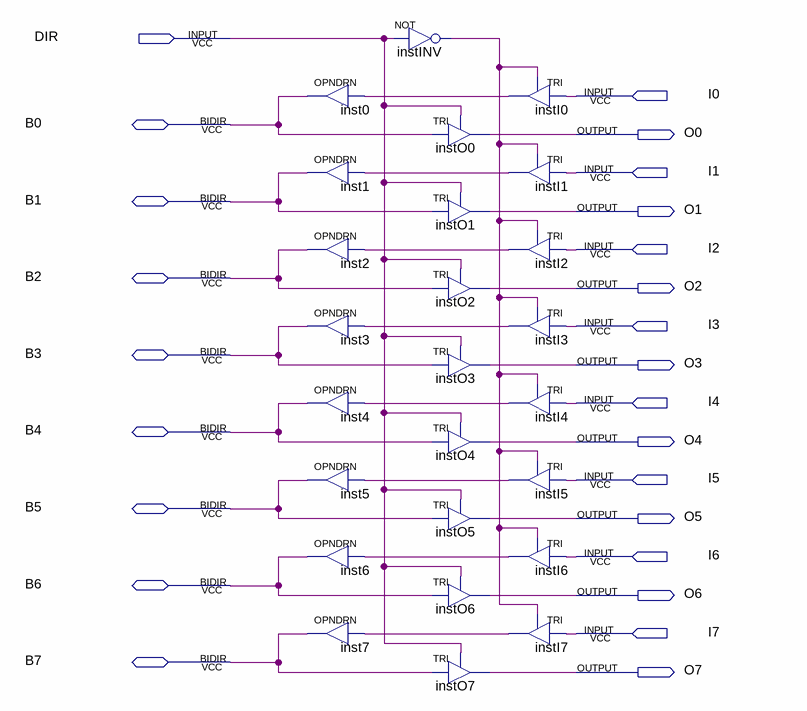
[diagram p0: schematic sheet]
// Quartus schematic 8bidir16o.bdf as structural Verilog: 25 symbols, 25 pins
module \8bidir16o  (
  input  DIR,
  input  I0,
  input  I1,
  input  I2,
  input  I3,
  input  I4,
  input  I5,
  input  I6,
  input  I7,
  inout  B0,
  inout  B1,
  inout  B2,
  inout  B3,
  inout  B4,
  inout  B5,
  inout  B6,
  inout  B7,
  output O0,
  output O1,
  output O2,
  output O3,
  output O4,
  output O5,
  output O6,
  output O7
);

  wire instI0_out, instI1_out, instI2_out, instI3_out, instI4_out, instI5_out, instI6_out, instI7_out,
       instINV_out;

  OPNDRN inst0 (.IN(instI0_out), .OUT(B0));
  OPNDRN inst1 (.IN(instI1_out), .OUT(B1));
  OPNDRN inst2 (.IN(instI2_out), .OUT(B2));
  OPNDRN inst3 (.IN(instI3_out), .OUT(B3));
  OPNDRN inst4 (.IN(instI4_out), .OUT(B4));
  OPNDRN inst5 (.IN(instI5_out), .OUT(B5));
  OPNDRN inst6 (.IN(instI6_out), .OUT(B6));
  OPNDRN inst7 (.IN(instI7_out), .OUT(B7));
  not instINV (instINV_out, DIR);
  TRI instO0 (.IN(B0), .OE(DIR), .OUT(O0));
  TRI instO1 (.IN(B1), .OE(DIR), .OUT(O1));
  TRI instO2 (.IN(B2), .OE(DIR), .OUT(O2));
  TRI instO3 (.IN(B3), .OE(DIR), .OUT(O3));
  TRI instO4 (.IN(B4), .OE(DIR), .OUT(O4));
  TRI instO5 (.IN(B5), .OE(DIR), .OUT(O5));
  TRI instO6 (.IN(B6), .OE(DIR), .OUT(O6));
  TRI instO7 (.IN(B7), .OE(DIR), .OUT(O7));
  TRI instI0 (.IN(I0), .OE(instINV_out), .OUT(instI0_out));
  TRI instI1 (.IN(I1), .OE(instINV_out), .OUT(instI1_out));
  TRI instI2 (.IN(I2), .OE(instINV_out), .OUT(instI2_out));
  TRI instI3 (.IN(I3), .OE(instINV_out), .OUT(instI3_out));
  TRI instI4 (.IN(I4), .OE(instINV_out), .OUT(instI4_out));
  TRI instI5 (.IN(I5), .OE(instINV_out), .OUT(instI5_out));
  TRI instI6 (.IN(I6), .OE(instINV_out), .OUT(instI6_out));
  TRI instI7 (.IN(I7), .OE(instINV_out), .OUT(instI7_out));
endmodule
